# Altium schematic sheet PeltierDrive.SchDoc
size A4
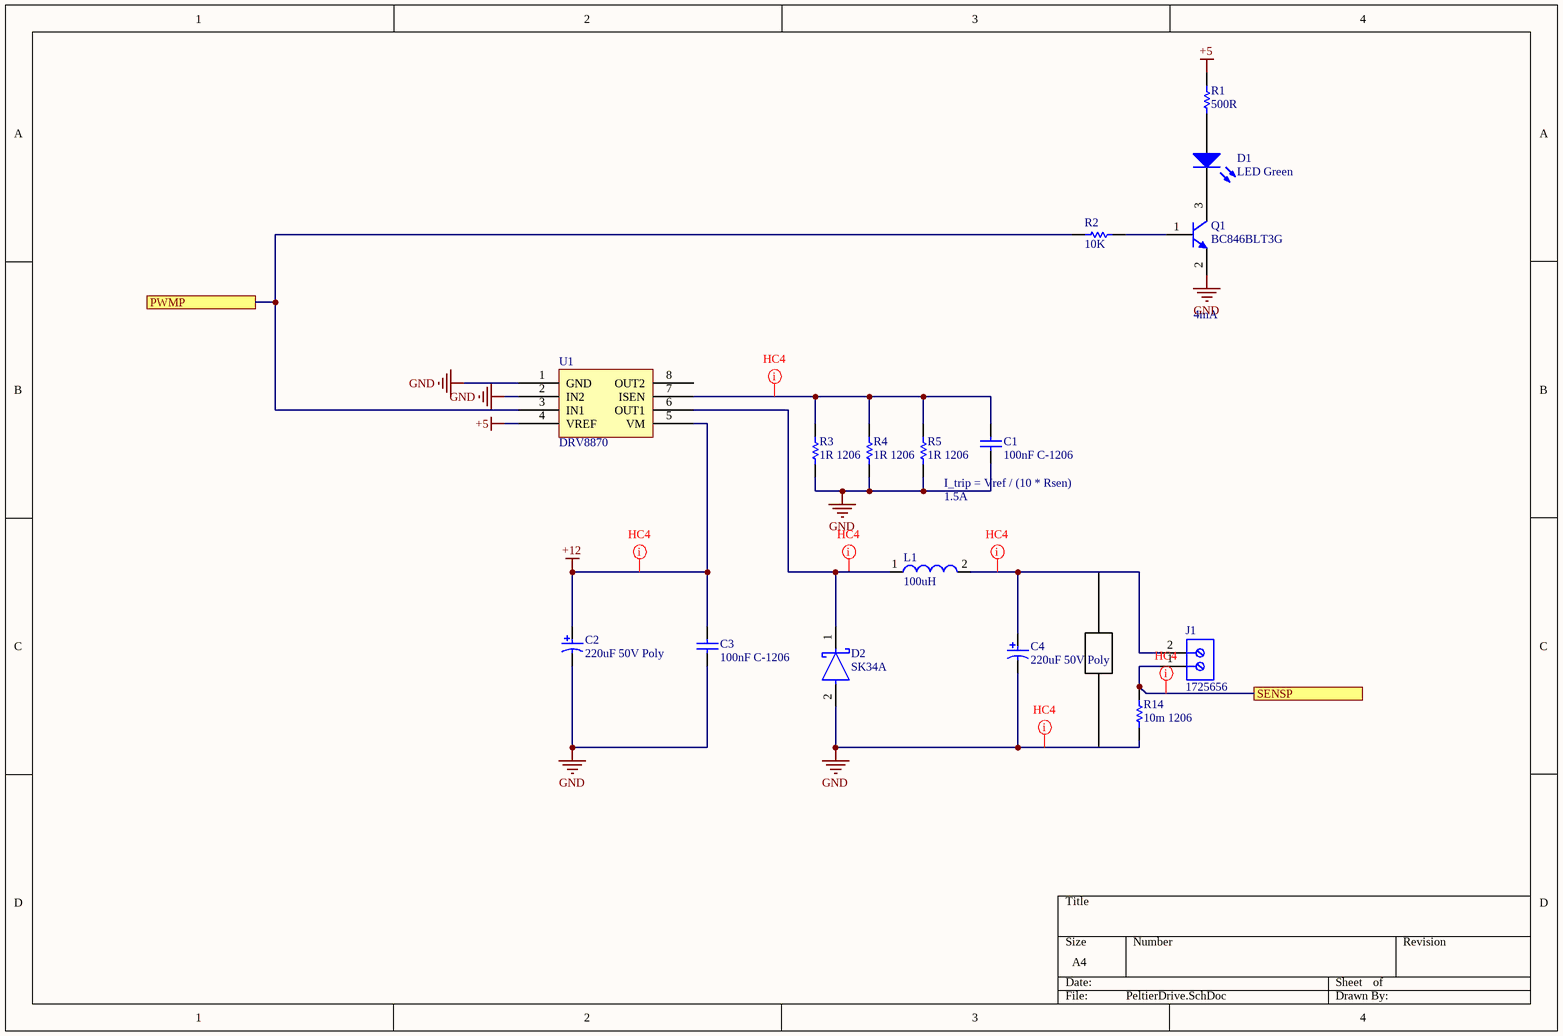
[diagram p0: PeltierDrive.SchDoc]

## Parts
C1  100nF C-1206  [C-1206]
C2  220uF 50V Poly  [CAPAE127P600-8N]
C3  100nF C-1206  [C-1206]
C4  220uF 50V Poly  [CAPAE127P600-8N]
D1  LED Green  [0603_A]
D2  SK34A  [FP-DO-214AC-MFG]
J1  1725656  [PHOE-1725656-2]
L1  100uH  [INDC177172X70N]
Q1  BC846BLT3G  [ONSC-SOT-23-3-318-08_V]
R1  500R  [RESC0603(1608)_L]
R2  10K  [RESC0603(1608)_N]
R3  1R 1206  [RESC1206(3216)_N]
R4  1R 1206  [RESC1206(3216)_N]
R5  1R 1206  [RESC1206(3216)_N]
R14  10m 1206  [RESC1206(3216)_N]
U1  DRV8870  [SOIC127P600X170_HS-9N]

## Ports
PWMP, SENSP

## Nets
+5: R1.2 U1.4(VREF)
+12: C2.1 C3.2 U1.5(VM)
GND: C1.1 C2.2 C3.1 C4.2 D2.2(A) Q1.2(E) R3.1 R4.1 R5.1 R14.1 U1.1(GND) U1.2(IN2)
PWMP: R2.1 U1.3(IN1) ; port PWMP
SENSP: J1.1 R14.2 ; port SENSP
NetC1_2: C1.2 R3.2 R4.2 R5.2 U1.7(ISEN)
NetC4_1: C4.1 J1.2 L1.2
NetD1_1: D1.1(K) Q1.3(C)
NetD1_2: D1.2(A) R1.1
NetD2_1: D2.1(C) L1.1 U1.6(OUT1)
NetQ1_1: Q1.1(B) R2.2

Not connected (* = marked no-connect by the designer): U1 8(OUT2)

## Layout directives
net class HC4: +12, GND, NetC1_2, NetC4_1, NetD2_1, SENSP

## Notes on the sheet
- 4mA
- I_trip = Vref / (10 * Rsen)
- 1.5A

## Library data of the parts
C1 C3 = C-1206: Ceramic 50V 1206; Case-EIA: 1206; Tolerance: Â±20%; Case-Metric: 3216; Max Thickness: 1 mm; Rated Voltage: 50 V; Value: 100nF; Technology: SMT
C2 C4 = C-Poly: Manufacturer: AVX; DELETED: Compliant; Product Depth (mm): 4.3mm; Product Length (mm): 7.3mm; Case Style: Molded; Product Diameter (mm): NotRequiredmm; DF: 6%; Seal: NotRequired; Capacitance: 22000000pF; Product Height (mm): 2.9mm; Rad Hardened: No; ESR: 0.2ohm; Polarity: Polar; DCL: 5.5uA; Voltage: 25VDC; Tolerance (+ or -): 10%; Construction: SMTChip; Mounting Style: SurfaceMount; Packaging: TapeandReel; Case Code: D; Package Reference: 7343-31; Manufacturer URL: http://www.avx.com/; Failure Rate: NotRequired; Insulation: NotRequired; Operating Temp Range: -55Cto125C; Mounting Technology: SurfaceMount; Package Description: 2-Pin Surface Mount Device, Body 7.3 x 4.35 mm; Length W/Weld (max): NotRequiredmm; Lead Spacing (nom): NotRequiredmm; Seated Plane Height: NotRequiredmm; Wire Form: NotRequired; Datasheet Version: 02/2004; Datasheet URL: https://datasheet.ciiva.com/11793/0900766b80066cb4-11793194.pdf; Length W/Weld: NotRequiredmm; Package / Case: 7343-31
D1 = CMP-1426-00002-1: SMD mono-color Chip LED, WL-SMCW, Green; PartNumber: 150060GS75000; Manufacturer: Wuerth Elektronik; ComponentLink1URL: http://www.we-online.com; ComponentLink2Description: Datasheet; Color: Green; ComponentLink2URL: http://katalog.we-online.com/led/datasheet/150060GS75000.pdf; PackageReference: 0603_A; ComponentLink1Description: Manufacturer URL
D2 = CMP-56206-000004-1: DIODE SCHOTTKY 5A 30V SMA; Mount: Surface Mount; Max Reverse Voltage (DC): 30V; Case/Package: SMA; Packaging: Tape and Reel; Average Rectified Current: 5A
J1 = CMP-2000-05299-1: Male Header, Pitch 2.54 mm, 1 x 2 Position, Height 9 mm, Tail Length 3.5 mm; Manufacturer: Phoenix Contact; Number of contacts: 2; Content: 250pc(s); Pitch: 2.54mm; Industrial packaging: Yes; Colour: Green; Manufacturer part No.: 1725656; Type: MPT0,5/2-2,54; Datasheet URL: http://datasheet.octopart.com/1725656-Phoenix-Contact-datasheet-5302866.pdf; Manufacturer URL: http://www.phoenixcontact.com/; Datasheet Version: Apr-08
L1 = Inductor1717: PA4344.104NLT / https://products.pulseelex.com/files/product_files/P771.pdf; Manufacturer: Wuerth Elektronik; PartNumber: 74479763215; Inductance: 1.50 ÂµH; ComponentLink1Description: Manufacturer URL; PackageReference: SMD 0603_A; ComponentLink1URL: http://www.we-online.com; ComponentLink2URL: http://katalog.we-online.de/kataloge/eisos/media/pdf/74479763215.pdf; ComponentLink2Description: Datasheet
Q1 = CMP-1048-00780-1: General Purpose Transistor, NPN Silicon, 3-Pin SOT-23, Pb-Free, Tape and Reel; Manufacturer: On Semiconductor; fT Min (MHz): 100; IC Continuous (A): 0.1; ComponentLink2Description: Datasheet; Packing: Tape and Reel; Mounting Technology: Surface Mount; Polarity: NPN; PackageDescription: 3-Pin Small Outline Transistor, Body 2.92 x 1.3 mm, Pitch 0.95 mm; ComponentLink1Description: Manufacturer URL; PackageVersion: Rev. AP, 11/2009; ComponentLink3Description: Package Specification; ComponentLink3URL: http://www.onsemi.cn/pub_link/Collateral/318-08.PDF; PartNumber: BC846BLT3G; RoHS: TRUE; ComponentLink2URL: http://www.onsemi.cn/pub_link/Collateral/BC846ALT1-D.PDF; PackageReference: SOT-23-3-318-08; DatasheetVersion: Rev. 11; ComponentLink1URL: http://www.onsemi.com/
R1 = CMP-1012-00067-1: 510R 0.1W 5% 0603 (1608 Metric)  SMD; Case-EIA: 0603; Value: 510.00 Ohm; Case-Metric: 1608; Technology: SMT; Power: 0.1 W; Tolerance: 5 %
R2 = CMP-1012-00623-1: 10K 0.1W 1% 0603 (1608 Metric)  SMD; Value: 10000.00 Ohm; Case-EIA: 0603; Case-Metric: 1608; Power: 0.1 W; Tolerance: 1 %; Technology: SMT
R3-R5 R14 = CMP-1014-00004-1: 1R2 0.25W 5% 1206 (3216 Metric)  SMD; Value: 1.20 Ohm; Case-Metric: 3216; Case-EIA: 1206; Power: 0.25 W; Technology: SMT; Tolerance: 5 %